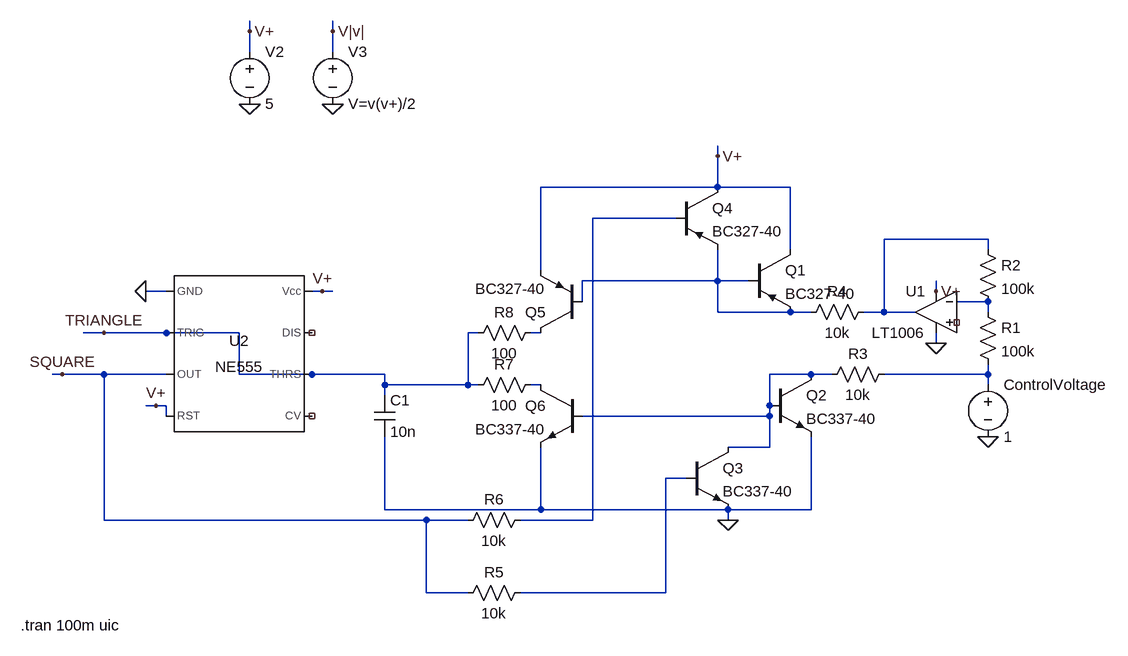
[diagram p0: schematic vcoofficial.asc]
vcoofficial.asc, the LTspice schematic file:
Version 4
SHEET 1 1256 680
WIRE -80 -368 -80 -384
WIRE 48 -368 48 -384
WIRE -80 -336 -80 -368
WIRE 48 -336 48 -368
WIRE 640 -176 640 -192
WIRE 640 -128 640 -176
WIRE 640 -128 368 -128
WIRE 752 -128 640 -128
WIRE 576 -80 448 -80
WIRE 1056 -48 896 -48
WIRE 752 -32 752 -128
WIRE 1056 -32 1056 -48
WIRE 368 0 368 -128
WIRE 640 16 640 -32
WIRE 640 16 432 16
WIRE 688 16 640 16
WIRE -208 32 -240 32
WIRE 32 32 16 32
WIRE 48 32 32 32
WIRE 976 32 976 16
WIRE 432 48 432 16
WIRE 1056 48 1008 48
WIRE 640 64 640 16
WIRE 752 64 640 64
WIRE 784 64 752 64
WIRE 896 64 896 -48
WIRE 896 64 864 64
WIRE 944 64 896 64
WIRE 1056 64 1056 48
WIRE -304 96 -336 96
WIRE -208 96 -304 96
WIRE -96 96 -208 96
WIRE 272 96 256 96
WIRE 368 96 352 96
WIRE 976 112 976 96
WIRE -368 160 -384 160
WIRE -304 160 -368 160
WIRE -208 160 -304 160
WIRE -96 160 -96 96
WIRE 16 160 -96 160
WIRE 128 160 16 160
WIRE 784 160 720 160
WIRE 816 160 784 160
WIRE 1056 160 1056 144
WIRE 1056 160 896 160
WIRE 128 176 128 160
WIRE 256 176 256 96
WIRE 256 176 128 176
WIRE 272 176 256 176
WIRE 368 176 352 176
WIRE 1056 176 1056 160
WIRE 128 192 128 176
WIRE -224 208 -240 208
WIRE -208 208 -224 208
WIRE 720 208 720 160
WIRE -208 224 -208 208
WIRE 720 224 720 208
WIRE 720 224 432 224
WIRE 720 272 720 224
WIRE 720 272 656 272
WIRE 592 320 560 320
WIRE 128 368 128 256
WIRE 368 368 368 272
WIRE 368 368 128 368
WIRE 656 368 368 368
WIRE 784 368 784 256
WIRE 784 368 656 368
WIRE -304 384 -304 160
WIRE 192 384 -304 384
WIRE 256 384 192 384
WIRE 448 384 448 -80
WIRE 448 384 336 384
WIRE 656 384 656 368
WIRE 192 496 192 384
WIRE 256 496 192 496
WIRE 560 496 560 320
WIRE 560 496 336 496
FLAG 976 112 0
FLAG 976 32 V+
FLAG 1056 256 0
FLAG 656 384 0
FLAG 640 -176 V+
FLAG -240 32 0
FLAG -80 -256 0
FLAG 48 -256 0
FLAG -80 -368 V+
FLAG 48 -368 V|v|
FLAG -304 96 TRIANGLE
FLAG -368 160 SQUARE
FLAG -224 208 V+
FLAG 32 32 V+
SYMBOL voltage 1056 160 R0
WINDOW 123 0 0 Left 0
WINDOW 39 0 0 Left 0
SYMATTR InstName ControlVoltage
SYMATTR Value 1
SYMBOL res 1040 48 R0
SYMATTR InstName R1
SYMATTR Value 100k
SYMBOL res 1040 -48 R0
SYMATTR InstName R2
SYMATTR Value 100k
SYMBOL OpAmps\\LT1006 976 0 M0
SYMATTR InstName U1
SYMBOL res 912 144 R90
WINDOW 0 0 56 VBottom 2
WINDOW 3 32 56 VTop 2
SYMATTR InstName R3
SYMATTR Value 10k
SYMBOL res 880 48 R90
WINDOW 0 0 56 VBottom 2
WINDOW 3 32 56 VTop 2
SYMATTR InstName R4
SYMATTR Value 10k
SYMBOL pnp 688 -32 R0
SYMATTR InstName Q1
SYMATTR Value BC327-40
SYMBOL npn 720 160 R0
SYMATTR InstName Q2
SYMATTR Value BC337-40
SYMBOL npn 592 272 R0
SYMATTR InstName Q3
SYMATTR Value BC337-40
SYMBOL pnp 576 -128 R0
SYMATTR InstName Q4
SYMATTR Value BC327-40
SYMBOL res 352 480 R90
WINDOW 0 0 56 VBottom 2
WINDOW 3 32 56 VTop 2
SYMATTR InstName R5
SYMATTR Value 10k
SYMBOL res 352 368 R90
WINDOW 0 0 56 VBottom 2
WINDOW 3 32 56 VTop 2
SYMATTR InstName R6
SYMATTR Value 10k
SYMBOL res 368 160 R90
WINDOW 0 0 56 VBottom 2
WINDOW 3 32 56 VTop 2
SYMATTR InstName R7
SYMATTR Value 100
SYMBOL res 368 80 R90
WINDOW 0 0 56 VBottom 2
WINDOW 3 32 56 VTop 2
SYMATTR InstName R8
SYMATTR Value 100
SYMBOL pnp 432 96 R180
SYMATTR InstName Q5
SYMATTR Value BC327-40
SYMBOL npn 432 176 M0
SYMATTR InstName Q6
SYMATTR Value BC337-40
SYMBOL cap 112 192 R0
SYMATTR InstName C1
SYMATTR Value 10n
SYMBOL Misc\\NE555 -96 128 R0
SYMATTR InstName U2
SYMBOL voltage 48 -352 R0
WINDOW 123 0 0 Left 0
WINDOW 39 0 0 Left 0
SYMATTR InstName V3
SYMATTR Value V=v(v+)/2
SYMBOL voltage -80 -352 R0
WINDOW 123 0 0 Left 0
WINDOW 39 0 0 Left 0
SYMATTR InstName V2
SYMATTR Value 5
TEXT -432 546 Left 2 !.tran 100m uic

The netlist it stands for:
* vcoofficial.asc
V§ControlVoltage N007 0 1
R1 N004 N007 100k
R2 N002 N004 100k
XU1 NC_01 N004 V+ 0 N002 LT1006  ; pins In+ In- V+ V- OUT
R3 N007 N006 10k
R4 N002 N003 10k
Q1 V+ N003 N003 0 BC327-40
Q2 N006 N006 0 0 BC337-40
Q3 N006 N009 0 0 BC337-40
Q4 V+ N001 N003 0 BC327-40
R5 N009 SQUARE 10k
R6 N001 SQUARE 10k
R7 N008 TRIANGLE 100
R8 N005 TRIANGLE 100
Q5 N005 N003 V+ 0 BC327-40
Q6 N008 N006 0 0 BC337-40
C1 TRIANGLE 0 10n
XU2 0 TRIANGLE SQUARE V+ NC_02 TRIANGLE NC_03 V+ NE555  ; pins GND TRIG OUT RST CV THRS DIS Vcc
V3 V|v| 0 V=v(v+)/2
V2 V+ 0 5
.model NPN NPN
.model PNP PNP
.lib standard.bjt
.tran 100m uic
.lib LTC.lib
.lib NE555.sub
.backanno
.end